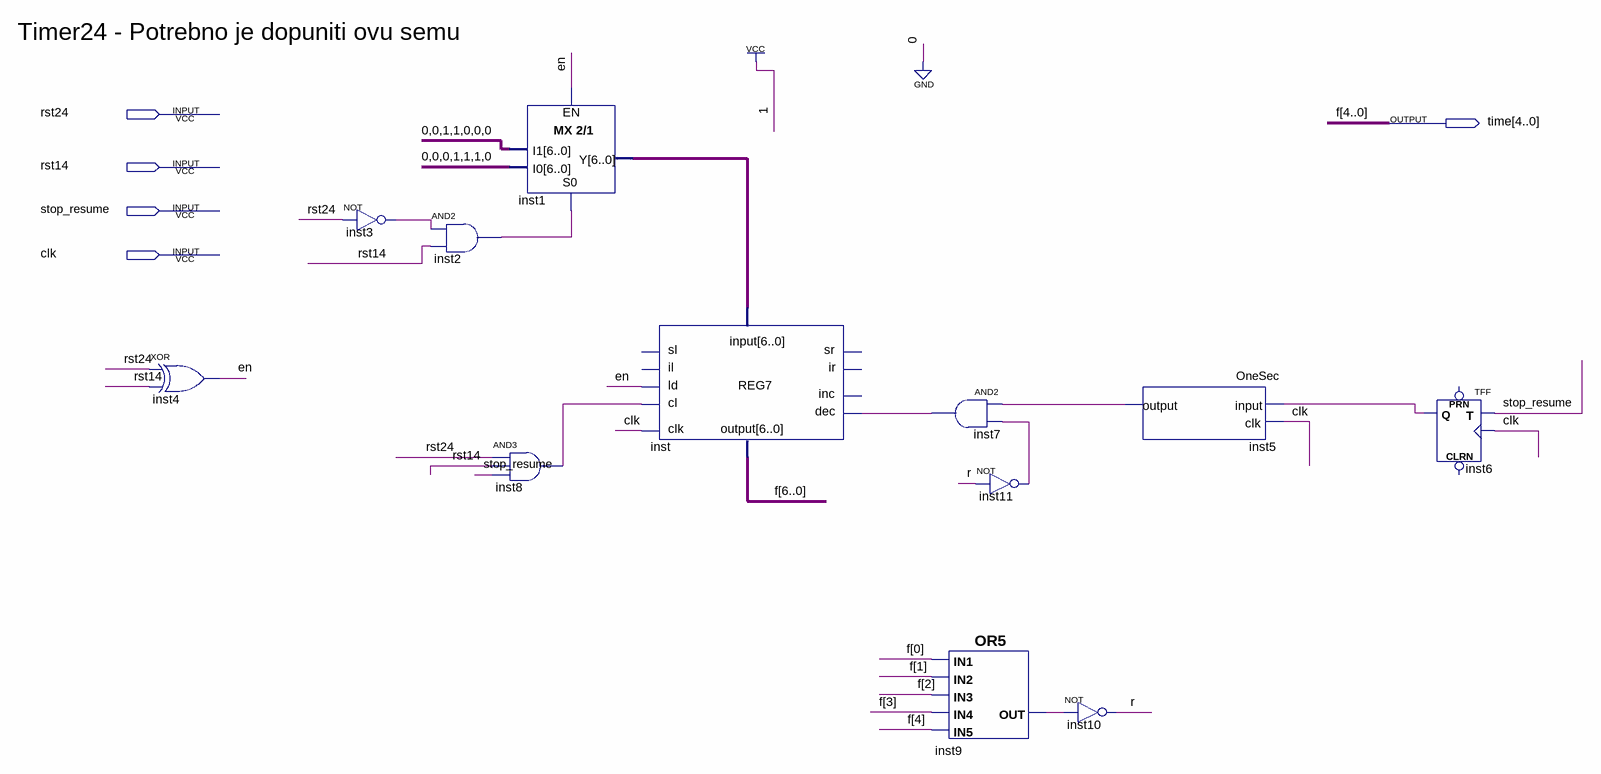
[diagram p0: schematic sheet]
// Quartus schematic Timer24.bdf as structural Verilog: 12 symbols, 5 pins
module Timer24 (
  input  rst24,
  input  rst14,
  input  stop_resume,
  input  clk,
  output [4:0] \time 
);

  wire en, inst2_out, inst3_out, inst5_output, inst6_q, inst7_out, inst8_out, inst9_out, inst11_out, r;
  wire [6:0] inst1_y;
  wire [6:5] f;

  xor inst4 (en, rst24, rst14);
  not inst3 (inst3_out, rst24);
  and inst2 (inst2_out, inst3_out, rst14);
  MX2_1 inst1 (.S0(inst2_out), .EN(en), .I0(7'b0001110), .I1(7'b0011000), .Y(inst1_y));
  and inst8 (inst8_out, rst24, rst14, stop_resume);
  REG7 inst (
    .clk(clk), .ld(en), .\input (inst1_y), .dec(inst7_out), .cl(inst8_out), .\output ({f, \time }));  // open: sr, ir, il, inc, sl
  and inst7 (inst7_out, inst5_output, inst11_out);
  or inst9 (inst9_out, \time [0], \time [1], \time [2], \time [3], \time [4]);
  not inst11 (inst11_out, r);
  not inst10 (r, inst9_out);
  OneSec inst5 (.\input (inst6_q), .clk(clk), .\output (inst5_output));
  TFF inst6 (.T(stop_resume), .CLK(clk), .Q(inst6_q));  // open: PRN, CLRN

  // Other names for the same wires on the sheet: f[4:0] = \time 

  // Notes on the sheet:
  //   Timer24 - Potrebno je dopuniti ovu semu
endmodule
